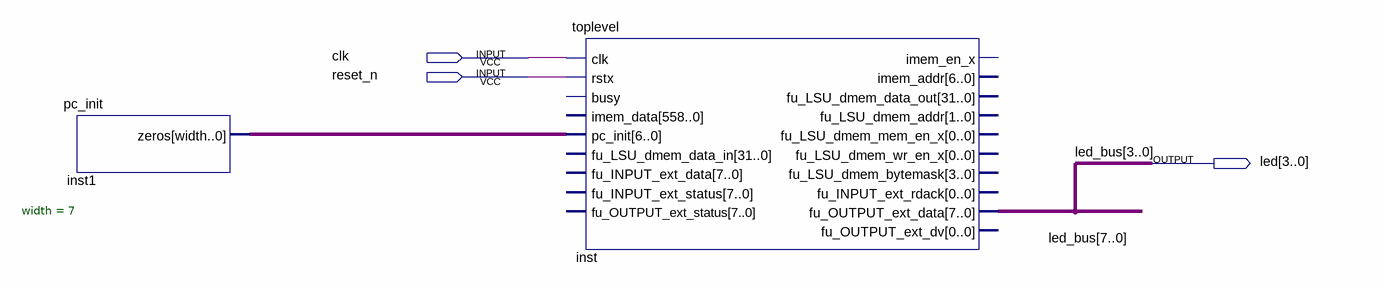
[diagram p0: schematic sheet]
// Quartus schematic tta_fir.bdf as structural Verilog: 2 symbols, 3 pins
module tta_fir (
  input  clk,
  input  reset_n,
  output [3:0] led
);

  wire [7:0] inst1_zeros;
  wire [7:4] led_bus;

  pc_init #(.width(7)) inst1 (.zeros(inst1_zeros));
  toplevel inst (
    .clk(clk), .rstx(reset_n), .pc_init(inst1_zeros), .fu_OUTPUT_ext_data({led_bus, led}));  // open: busy, imem_data, fu_LSU_dmem_data_in, fu_INPUT_ext_data, fu_INPUT_ext_status, fu_OUTPUT_ext_status, imem_en_x, imem_addr, fu_LSU_dmem_data_out, fu_LSU_dmem_addr, fu_LSU_dmem_mem_en_x, fu_LSU_dmem_wr_en_x, fu_LSU_dmem_bytemask, fu_INPUT_ext_rdack, fu_OUTPUT_ext_dv

  // Other names for the same wires on the sheet: led_bus[3:0] = led
endmodule
